# EAGLE schematic esp32 with ADE9153a ic (EAGLE 9.6.2)
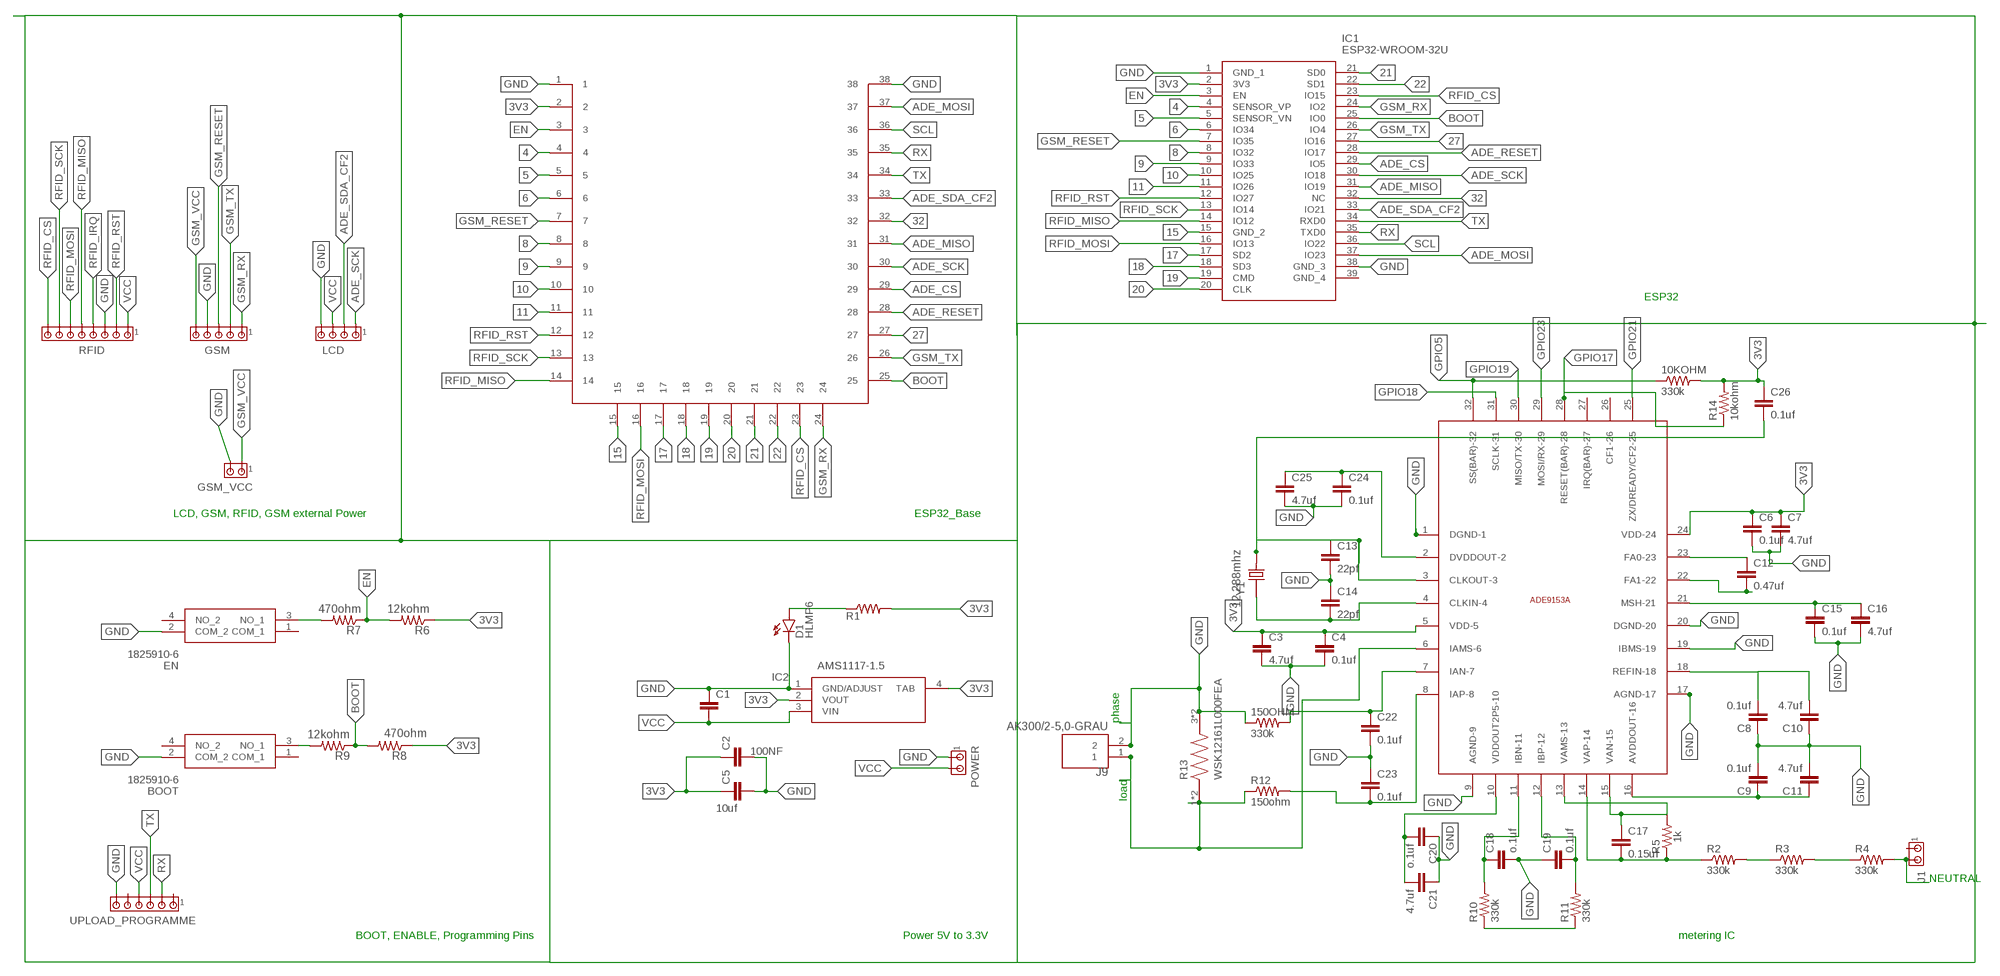
[diagram p0: schematic, sheet 1]

## Parts
10KOHM  330k  R-US_0204/7  [0204/7]
150OHM  330k  R-US_0204/7  [0204/7]
BOOT  1825910-6  [18259106]
C1  C2,5-3  [C2.5-3]
C2  100NF  C2,5-3  [C2.5-3]
C3  4.7uf  C2.5/2  [C2.5-2]
C4  0.1uf  C2.5/2  [C2.5-2]
C5  10uf  C2,5-3  [C2.5-3]
C6  0.1uf  C2.5/2  [C2.5-2]
C7  4.7uf  C2.5/2  [C2.5-2]
C8  0.1uf  C2.5/2  [C2.5-2]
C9  0.1uf  C2.5/2  [C2.5-2]
C10  4.7uf  C2.5/2  [C2.5-2]
C11  4.7uf  C2.5/2  [C2.5-2]
C12  0.47uf  C2.5/2  [C2.5-2]
C13  22pf  C2.5/2  [C2.5-2]
C14  22pf  C2.5/2  [C2.5-2]
C15  0.1uf  C2.5/2  [C2.5-2]
C16  4.7uf  C2.5/2  [C2.5-2]
C17  0.15uf  C2.5/2  [C2.5-2]
C18  o.1uf  C2.5/2  [C2.5-2]
C19  0.1uf  C2.5/2  [C2.5-2]
C20  o.1uf  C2.5/2  [C2.5-2]
C21  4.7uf  C2.5/2  [C2.5-2]
C22  0.1uf  C2.5/2  [C2.5-2]
C23  0.1uf  C2.5/2  [C2.5-2]
C24  0.1uf  C2.5/2  [C2.5-2]
C25  4.7uf  C2.5/2  [C2.5-2]
C26  0.1uf  C2.5/2  [C2.5-2]
D1  HLMP6  [HLMP6]
EN  1825910-6  [18259106]
GSM  MTA05-156  [1X5MTA]
GSM_VCC  MTA02-156  [1X2MTA]
IC1  ESP32-WROOM-32U  [ESP32WROOM32D]
IC2  AMS1117-1.5  [SOT229P700X180-4N]
J1  MTA02-156  [1X2MTA]
J9  AK300/2-5,0-GRAU  [PTR_AK300/2-5,0-GRAU]
LCD  MTA04-156  [1X4MTA]
POWER  MTA02-156  [1X2MTA]
R1  R-US_0204/7  [0204/7]
R2  330k  R-US_0204/7  [0204/7]
R3  330k  R-US_0204/7  [0204/7]
R4  330k  R-US_0204/7  [0204/7]
R5  1k  R-US_0204/7  [0204/7]
R6  12kohm  2-2176053-0  [RESC2012X65N]
R7  470ohm  2-2176053-0  [RESC2012X65N]
R8  470ohm  2-2176053-0  [RESC2012X65N]
R9  12kohm  2-2176053-0  [RESC2012X65N]
R10  330k  R-US_0204/7  [0204/7]
R11  330k  R-US_0204/7  [0204/7]
R12  150ohm  R-US_0204/7  [0204/7]
R13  WSK12161L000FEA  [RES_WSK12161L000FEA]
R14  10kohm  R-US_0204/7  [0204/7]
RFID  MTA08-156  [1X8MTA]
U$1  LIB1SHIV_KUMAR  [1X14MTA]
U$2  ADE9153A_BASEADE9153A_BASE  [ADE9153A_BASE]
UPLOAD_PROGRAMME  MTA06-156  [1X6MTA]
Y1  12.288mhz  ECS-240.0001-18-1X  [XTAL_ECS-200-20-1X]

## Nets
3V3: 10KOHM.2 C2.1 C3.1 C4.1 C5.1 C6.1 C7.1 C26.1 IC1.2(3V3) IC2.2(VOUT) IC2.4(TAB) R1.2 R6.1 R8.1 R14.2 U$1.2 U$2.5(VDD-5) U$2.24(VDD-24)
4: IC1.4(SENSOR_VP) U$1.4
5: IC1.5(SENSOR_VN) U$1.5
6: IC1.6(IO34) U$1.6
8: IC1.8(IO32) U$1.8
9: IC1.9(IO33) U$1.9
10: IC1.10(IO25) U$1.10
11: IC1.11(IO26) U$1.11
15: IC1.15(GND_2) U$1.15
17: IC1.17(SD2) U$1.17
18: IC1.18(SD3) U$1.18
19: IC1.19(CMD) U$1.19
20: IC1.20(CLK) U$1.20
21: IC1.21(SD0) U$1.21
22: IC1.22(SD1) U$1.22
27: IC1.27(IO16) U$1.27
32: IC1.32(NC) U$1.32
ADE_CS: IC1.29(IO5) U$1.29
ADE_MISO: IC1.31(IO19) U$1.31
ADE_MOSI: IC1.37(IO23) U$1.37
ADE_RESET: IC1.28(IO17) U$1.28
ADE_SCK: IC1.30(IO18) LCD.1 U$1.30
ADE_SDA_CF2: IC1.33(IO21) LCD.2 U$1.33
BOOT: IC1.25(IO0) R8.2 R9.1 U$1.25
EN: IC1.3(EN) R6.2 R7.1 U$1.3
GND: 150OHM.1 BOOT.2(COM_2) C1.1 C2.2 C3.2 C4.2 C5.2 C6.2 C7.2 C8.1 C9.2 C10.1 C11.2 C13.2 C14.1 C15.2 C16.2 C18.2 C19.1 C20.1 C21.1 C22.2 C23.1 C24.2 C25.2 D1.K EN.2(COM_2) GSM.4 GSM_VCC.2 IC1.1(GND_1) IC1.38(GND_3) IC2.1(GND/ADJUST) J9.2 LCD.4 POWER.1 R13.3 R13.4 RFID.3 U$1.1 U$1.38 U$2.1(DGND-1) U$2.9(AGND-9) U$2.17(AGND-17) U$2.19(IBMS-19) U$2.20(DGND-20) UPLOAD_PROGRAMME.6
GPIO5: 10KOHM.1 U$2.32(SS(BAR)-32)
GPIO17: R14.1 U$2.28(RESET(BAR)-28)
GPIO18: U$2.31(SCLK-31)
GPIO19: U$2.30(MISO/TX-30)
GPIO21: U$2.25(ZX/DREADY/CF2-25)
GPIO23: U$2.29(MOSI/RX-29)
GSM_RESET: GSM.3 IC1.7(IO35) U$1.7
GSM_RX: GSM.1 IC1.24(IO2) U$1.24
GSM_TX: GSM.2 IC1.26(IO4) U$1.26
GSM_VCC: GSM.5 GSM_VCC.1
N$3: C9.1 C11.1 U$2.16(AVDDOUT-16)
N$4: C8.2 C10.2 U$2.18(REFIN-18)
N$5: C12.1 U$2.23(FA0-23)
N$6: C12.2 U$2.22(FA1-22)
N$7: C14.2 U$2.4(CLKIN-4) Y1.1
N$8: C13.1 C26.2 U$2.3(CLKOUT-3) Y1.2
N$9: C15.1 C16.1 U$2.21(MSH-21)
N$11: C17.2 R2.1 R5.1 U$2.14(VAP-14)
N$12: R2.2 R3.1
N$13: R3.2 R4.1
N$14: C17.1 R5.2 U$2.13(VAMS-13) U$2.15(VAN-15)
N$15: C19.2 R11.2 U$2.12(IBP-12)
N$16: C18.1 R10.2 U$2.11(IBN-11)
N$18: C20.2 C21.2 U$2.10(VDDOUT2P5-10)
N$19: R10.1 R11.1
N$20: 150OHM.2 C22.1 U$2.7(IAN-7)
N$21: C23.2 R12.2 U$2.8(IAP-8)
N$22: C24.1 C25.1 U$2.2(DVDDOUT-2)
N$23: EN.3(NO_1) R7.2
N$24: J9.1 R12.1 R13.1 R13.2 U$2.6(IAMS-6)
N$27: J1.2 R4.2
N$39: BOOT.3(NO_1) R9.2
N$41: D1.A R1.1
RFID_CS: IC1.23(IO15) RFID.8 U$1.23
RFID_IRQ: RFID.4
RFID_MISO: IC1.14(IO12) RFID.5 U$1.14
RFID_MOSI: IC1.16(IO13) RFID.6 U$1.16
RFID_RST: IC1.12(IO27) RFID.2 U$1.12
RFID_SCK: IC1.13(IO14) RFID.7 U$1.13
RX: IC1.35(TXD0) U$1.35 UPLOAD_PROGRAMME.2
SCL: IC1.36(IO22) U$1.36
TX: IC1.34(RXD0) U$1.34 UPLOAD_PROGRAMME.3
VCC: C1.2 IC2.3(VIN) LCD.3 POWER.2 RFID.1 UPLOAD_PROGRAMME.4
Unconnected: BOOT.1(COM_1) BOOT.4(NO_2) EN.1(COM_1) EN.4(NO_2) IC1.39(GND_4) J1.1 U$2.26(CF1-26) U$2.27(IRQ(BAR)-27) UPLOAD_PROGRAMME.1 UPLOAD_PROGRAMME.5

## Notes on the sheet
- ESP32
- LCD, GSM, RFID, GSM external Power | ESP32_Base
- phase
- load
- NEUTRAL
- BOOT, ENABLE, Programming Pins | Power 5V to 3.3V | metering IC

## Library data of the parts
10KOHM 150OHM R1-R5 R10-R12 R14 = rcl:R-US_: RESISTOR, American symbol; SPICEPREFIX: R
BOOT EN = 1825910-6:1825910-6: FSM4JH=6MM TACT SWITCH, HIGH TEMP Source: Datasheet <https://www.te.com/commerce/DocumentDelivery/DDEController?Action=srchrtrv&DocNm=1825910&DocType=Customer Drawing&DocLang=English&DocFormat=pdf&PartCntxt=1825910-6>; ARROW_PART_NUMBER: 1825910-6; ARROW_PRICE-STOCK: https://www.arrow.com/en/products/1825910-6/te-connectivity?region=europe; DESCRIPTION: FSM4JH=6MM TACT SWITCH, HIGH TEMP; HEIGHT: 5.3mm; MANUFACTURER_NAME: TE Connectivity; MANUFACTURER_PART_NUMBER: 1825910-6; MF: ALCOSWITCH - TE CONNECTIVITY; MOUSER_PART_NUMBER: N/A; MOUSER_PRICE-STOCK: https://www.mouser.co.uk/ProductDetail/TE-Connectivity/1825910-6?qs=A6cQTCBcXncisYDS1KbpGA%3D%3D; MPN: FSM4JH; OC_FARNELL: 1555982
C1-C26 = capacitor-wima:C: CAPACITOR naming: grid - package width
D1 = display-hp:HLMP6: LED 2mm horizontal; MF: AGILENT TECHNOLOGIES; MPN: HLMP-6500; OC_FARNELL: 1652490; OC_NEWARK: 40K0088
GSM = con-amp:MTA05-156: AMP connector
GSM_VCC J1 POWER = con-amp:MTA02-156: AMP connector
IC1 = ESP32-WROOM-32U:ESP32-WROOM-32U: WiFi Modules (802.11) SMD Module, ESP32-D0WD, 32Mbits SPI flash, UART mode, U.FL antenna connector Source: Datasheet <https://www.mouser.de/datasheet/2/891/esp32-wroom-32d_esp32-wroom-32u_datasheet_en-1365844.pdf>; DESCRIPTION: WiFi Modules (802.11) SMD Module, ESP32-D0WD, 32Mbits SPI flash, UART mode, U.FL antenna connector; HEIGHT: 3.1mm; MANUFACTURER_NAME: Espressif Systems; MANUFACTURER_PART_NUMBER: ESP32-WROOM-32U; MOUSER_PART_NUMBER: 356-ESP32-WROOM-32U; OC_FARNELL: unknown
IC2 = AMS1117-1.5:AMS1117-1.5: 1A LOW DROPOUT VOLTAGE REGULATOR Source: Datasheet <http://www.advanced-monolithic.com/pdf/ds1117.pdf>; DESCRIPTION: 1A LOW DROPOUT VOLTAGE REGULATOR; HEIGHT: 1.8mm; MANUFACTURER_NAME: ams; MANUFACTURER_PART_NUMBER: AMS1117-1.5; OC_FARNELL: unknown
J9 = AK300_2-5_0-GRAU:AK300/2-5,0-GRAU: Terminal block; 5mm; angled 45°; ways: 2 Check availability <https://pricing.snapeda.com/parts/AK300/2-5%2C0-GRAU/PTR%20Messtechnik/view-part?ref=eda>; AVAILABILITY: Not in stock; DESCRIPTION: Terminal block; 5mm; angled 45°; ways: 2; MF: PTR Messtechnik; MP: AK300/2-5,0-GRAU; PACKAGE: None; PRICE: None
LCD = con-amp:MTA04-156: AMP connector
R6-R9 = 2-2176053-0:2-2176053-0: RLP73N 2A R33 1% 1K RL Check availability <https://pricing.snapeda.com/parts/2-2176053-0/TE%20Connectivity/view-part?ref=eda>; AVAILABILITY: In Stock; COMMENT: 2-2176053-0; DESCRIPTION: RES 0.33 OHM 1% 1/4W 0805; EU_ROHS_COMPLIANCE: Compliant with Exemptions; MF: TE Connectivity; MP: 2-2176053-0; PACKAGE: 0805; PRICE: None
R13 = WSK12161L000FEA:WSK12161L000FEA: 1 mOhms ±1% 3W Chip Resistor Wide 1612 (3831 Metric), 1216 Current Sense, Moisture Resistant, Pulse Withstanding Metal Element Check availability <https://pricing.snapeda.com/parts/WSK12161L000FEA/Vishay%20Intertechnology/view-part?ref=eda>; AVAILABILITY: In Stock; DESCRIPTION: 1 mOhms ±1% 3W Chip Resistor Wide 1612 (3831 Metric), 1216 Anti-Sulfur, Automotive AEC-Q200, Current Sense, Pulse Withstanding Metal Element; MF: Vishay Intertechnology; MP: WSK12161L000FEA; PACKAGE: None; PRICE: None; PURCHASE-URL: https://pricing.snapeda.com/search/part/WSK12161L000FEA/?ref=eda
RFID = con-amp:MTA08-156: AMP connector
U$1 = ESP_CONN:LIB1
U$2 = ADE9153A_base:ADE9153A_BASE
UPLOAD_PROGRAMME = con-amp:MTA06-156: AMP connector
Y1 = ECS-240.0001-18-1X:ECS-240.0001-18-1X: Crystal HC49/U T/H Check availability <https://pricing.snapeda.com/parts/ECS-240.0001-18-1X/ECS%20International/view-part?ref=eda>; AVAILABILITY: In Stock; DESCRIPTION: Crystals / Oscillators / Resonators 24.00014MHz 18pF; MF: ECS International; MP: ECS-240.0001-18-1X; PACKAGE: HC49/U ECS International; PRICE: None